# Altium schematic sheet Regulador.SchDoc: PLACA POTÊNCIA REVISÃO C
size A3; DocumentNumber: GA0049; SheetNumber: 4; SheetTotal: 4
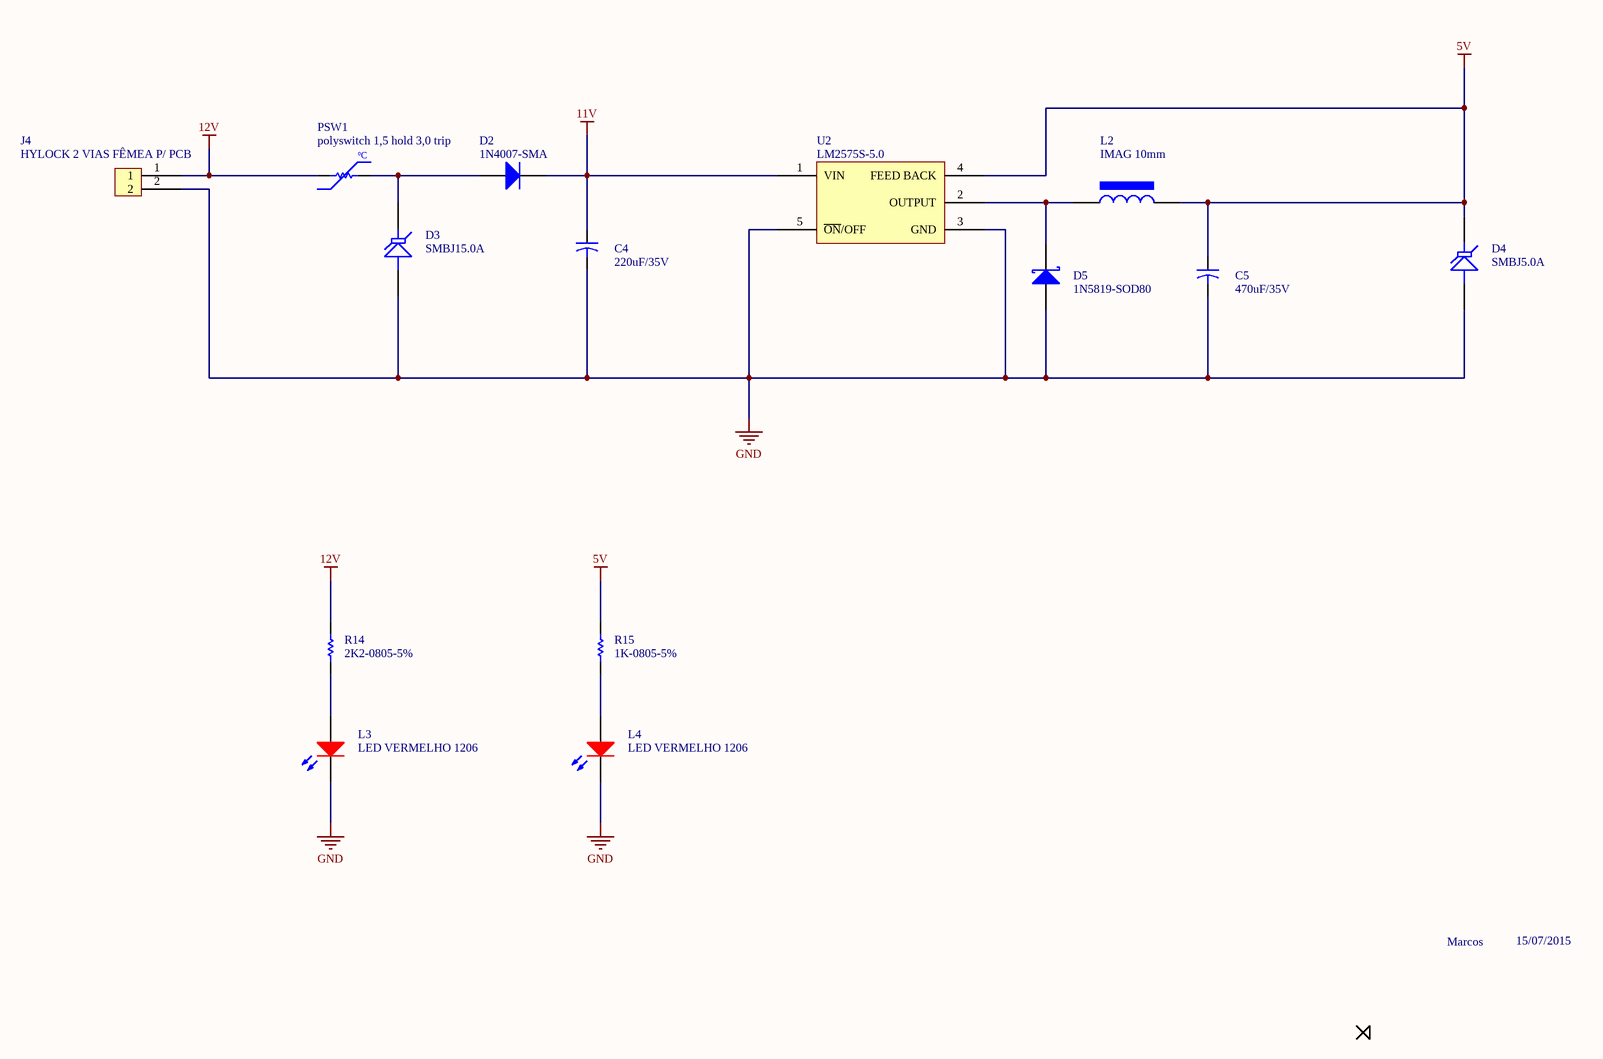
[diagram p0: Regulador.SchDoc]

## Parts
C4  220uF/35V  [CAP POL 8x12mm]
C5  470uF/35V  [CAP POL 8x12mm]
D2  1N4007-SMA  [SMA DIODES]
D3  SMBJ15.0A  [SMA DIODES]
D4  SMBJ5.0A  [SMA DIODES]
D5  1N5819-SOD80  [SMA DIODES]
J4  HYLOCK 2 VIAS FÊMEA P/ PCB  [CONECTOR HYLOCK 2 VIAS]
L2  IMAG 10mm  [INDUTOR 47mH]
L3  LED VERMELHO 1206  [LED 1206]
L4  LED VERMELHO 1206  [LED 1206]
PSW1  polyswitch 1,5 hold 3,0 trip  [1206-REVISADO ONDA]
R14  2K2-0805-5%  [0805-REVISADO ONDA]
R15  1K-0805-5%  [0805-REVISADO ONDA]
U2  LM2575S-5.0  [TO-263-5]

## Nets
5V: C5.1 D4.2(K) L2.1 R15.2 U2.4(FEED_BACK)
11V: C4.1 D2.2(K) U2.1(VIN)
12V: J4.1 PSW1.1 R14.2
GND: C4.2 C5.2 D3.1(A) D4.1(A) D5.1(A) J4.2 L3.2(K) L4.2(K) U2.3(GND) U2.5(~{ON}/OFF)
NetD2_1: D2.1(A) D3.2(K) PSW1.2
NetD5_2: D5.2(K) L2.2 U2.2(OUTPUT)
NetL3_1: L3.1(A) R14.1
NetL4_1: L4.1(A) R15.1

## Notes on the sheet
- Marcos
- 15/07/2015
- NOME
- DATA
- PROJETO
- DESCRIÇÃO
- www.quarktee.com.br
- desenho
- verif.
- aprov.
- TAMANHO
- CODIGO
- Todas as informações disponíveis
- não devem ser divulgadas,
- em parte ou todo.
- CIRCUITO IMPRESSO
- MONTAGEM ELETRÔNICA
- A4
- de
- (in symbol POLYSWITCH 200mA) ºC

## Library data of the parts
C4 = 2200uF/50V: ERP: 105.01.008
C5 = 470uF/50V: ERP: 105.01.005
D2 = 1N4007: ERP: 120.18.001
D3 = SMBJ30.0A: ERP: 128.02.003
J4 = PCMC2-2
L2 = indutor 1mH CNF15: 1mH-CNF15-26 AWG; ERP: 211.00.012
L3 L4 = LED VERMELHO 5mm: ERP: 125.01.001
PSW1 = POLYSWITCH 200mA: NANOSMDC020F-2; ERP: 128.12.002
R14 = 1K-0805-5%: ERP: 102.11.042
U2 = LM2596S-ADJ
D4 = SMBJ5.0A: ERP: 128.02.002
D5 = 1N5819-SOD80: ERP: 121.18.003
R15 = 1K-0805-5%: ERP: 102.11.042